# Altium schematic sheet 7-SOM PIO.SchDoc
size 420 x 297 mm; CompanyName: Microchip Technology Inc.; Organization: Microchip Technology; Address1: 2355 West Chandler Blvd.; Address2: Chandler, AZ  85224; Address4: USA; SheetTitle: **; Time: Time
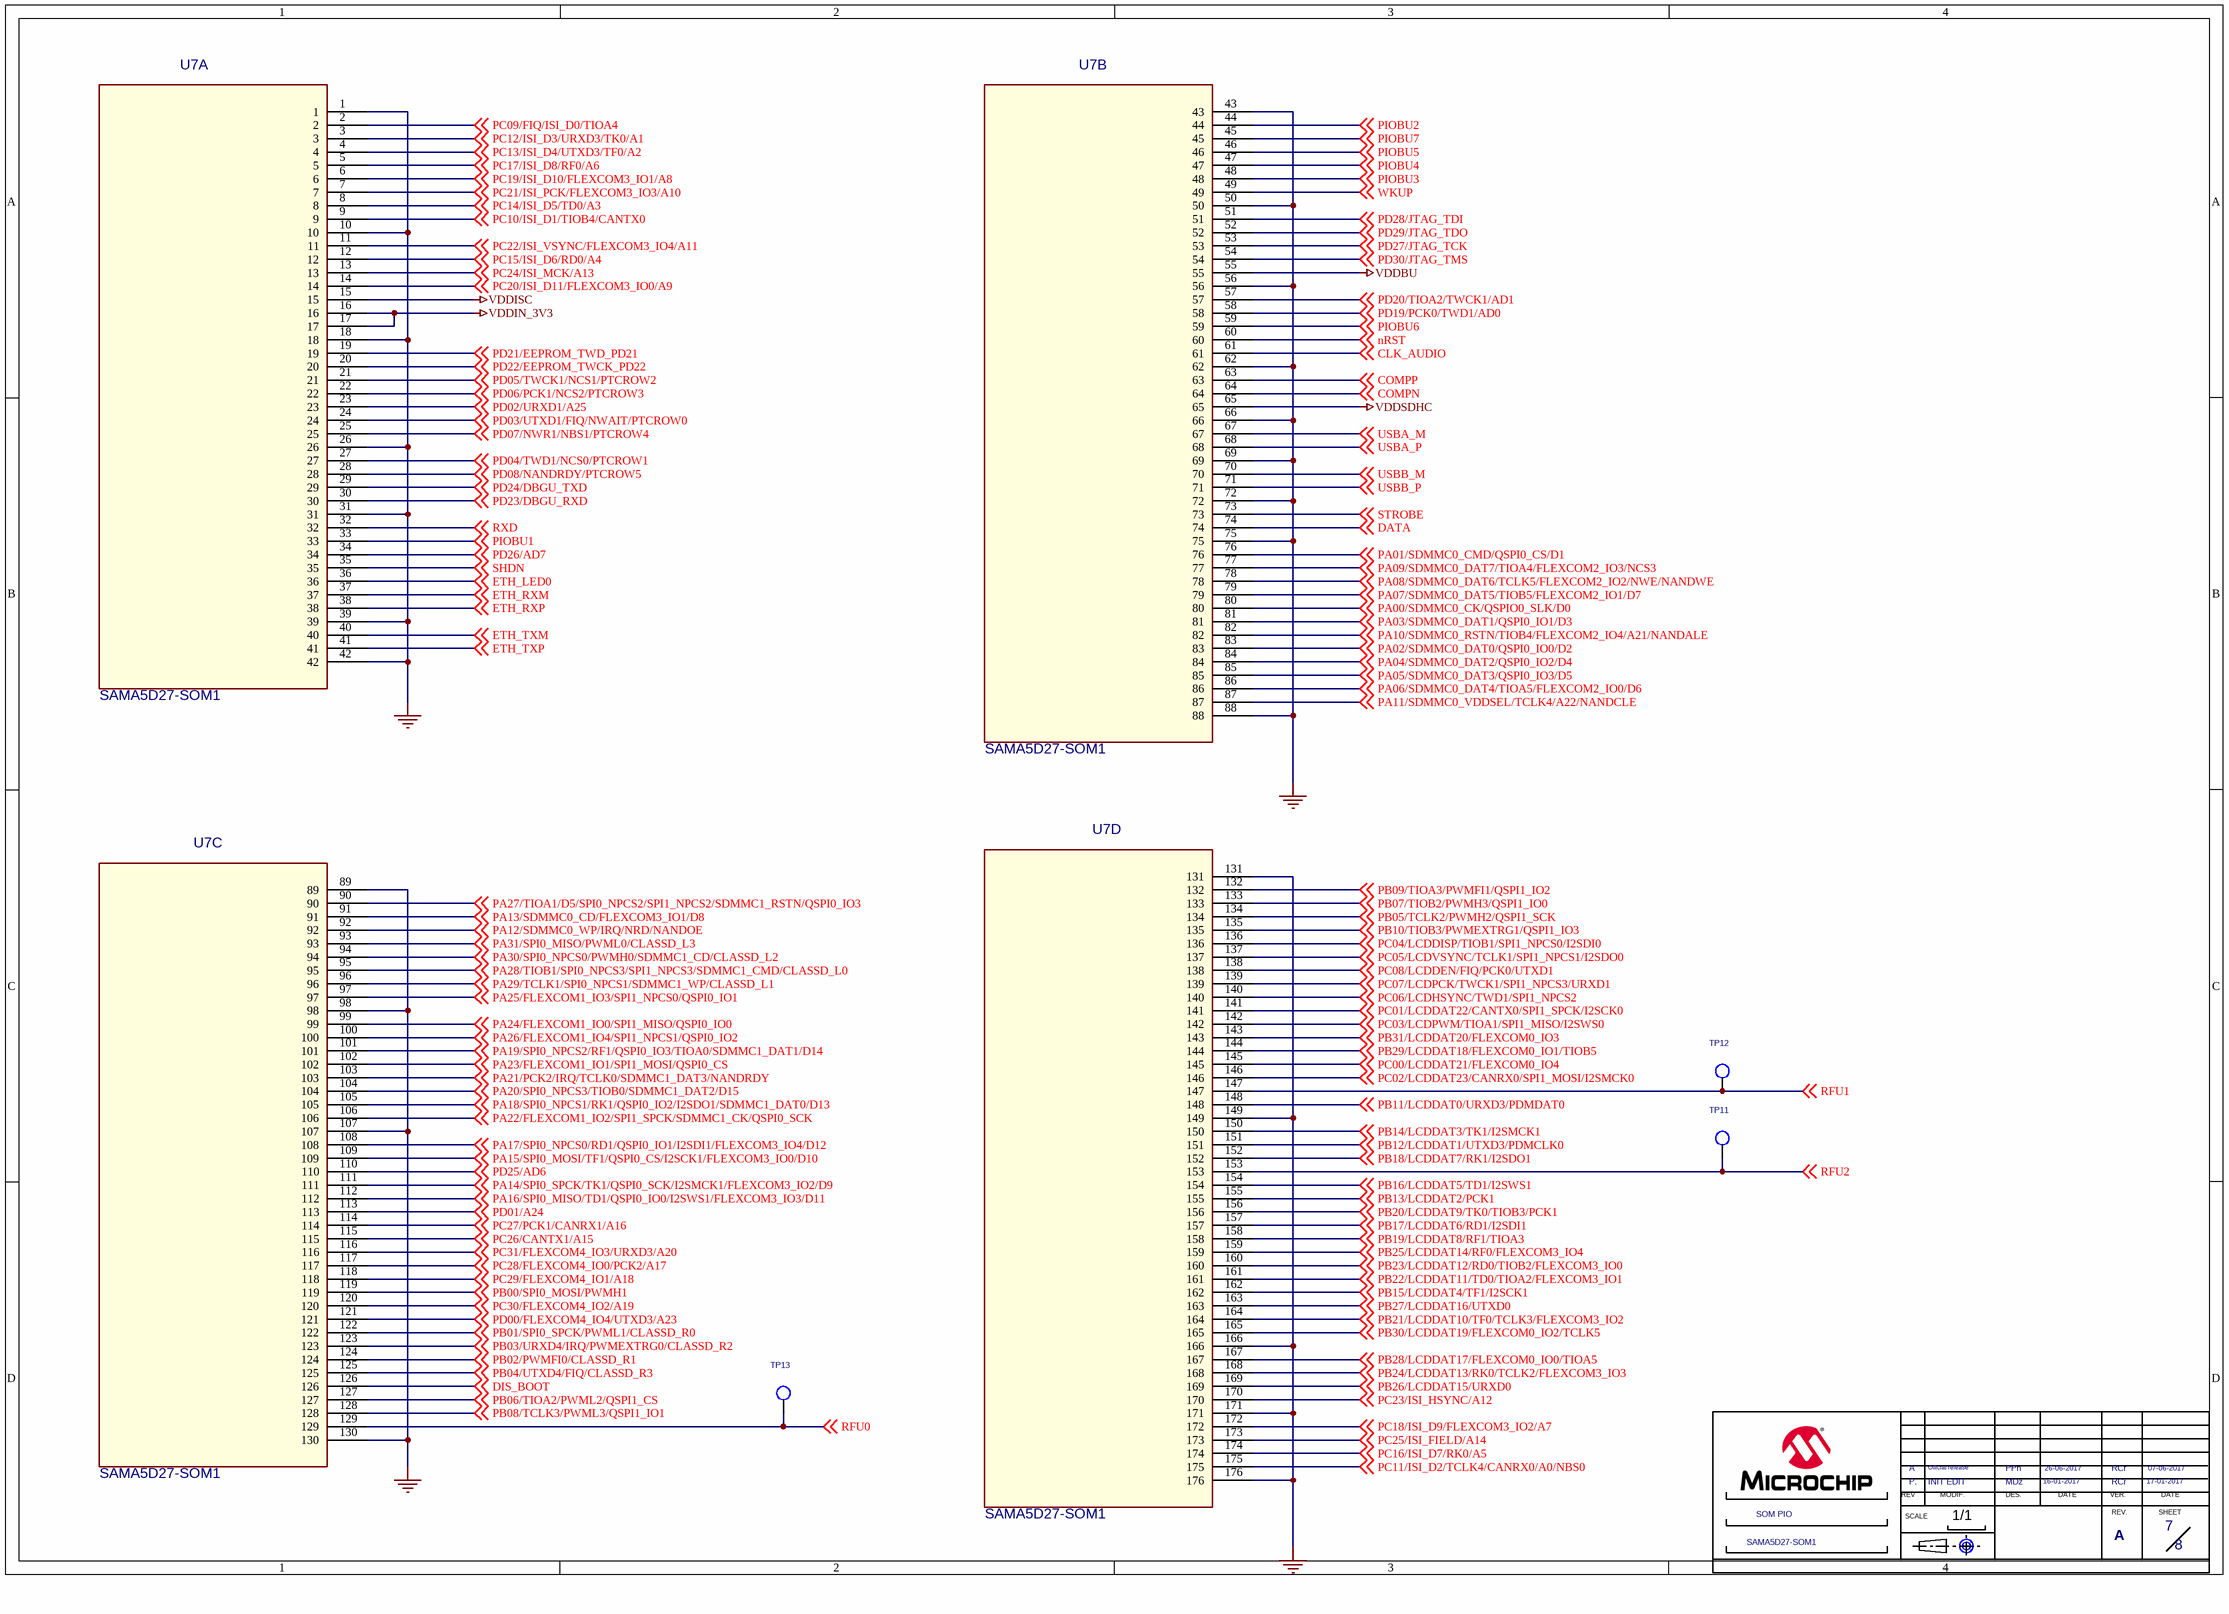
[diagram p0: 7-SOM PIO.SchDoc]

## Parts
*  MODIF.A: INIT EDIT  SHEET NAME 2: SOM PIO  SHEET NAME 1: SAMA5D27-SOM1  REV B: A  VERIF B: RCr  VERIF DATE A: 17-01-2017  VERIF DATE B: 07-06-2017  Page Count: 8  Page Number: 7  DATE A: 16-01-2017  DATE B: 26-06-2017  DES A: MDz  DES B: PPn  MODIF.B: Official release  REV A: P.  (hidden comment: CARTOUCHE MICROCHIP)  (graphical)
?  (no value)  (graphical)
TP11  TP  [tp-cmsrond-1mm_02]  (value not drawn)
TP12  TP  [tp-cmsrond-1mm_02]  (value not drawn)
TP13  TP  [tp-cmsrond-1mm_02]  (value not drawn)
U7  SAMA5D27-SOM1  [SAMA5D27-DXG-SOM1]  (parts A,B,C,D of 4)

## Nets
GND: U7.1 U7.10 U7.18 U7.26 U7.31 U7.39 U7.42 U7.43 U7.50 U7.56 U7.62 U7.66 U7.69 U7.72 U7.75 U7.88 U7.89 U7.98 U7.107 U7.130 U7.131 U7.149 U7.166 U7.171 U7.176
VDDBU: U7.55
VDDIN_3V3: U7.16 U7.17
VDDISC: U7.15
VDDSDHC: U7.65
CLK_AUDIO: U7.61 ; off-sheet CLK_AUDIO
COMPN: U7.64 ; off-sheet COMPN
COMPP: U7.63 ; off-sheet COMPP
DATA: U7.74 ; off-sheet DATA
DIS_BOOT: U7.126 ; off-sheet DIS_BOOT
ETH_LED0: U7.36 ; off-sheet ETH_LED0
ETH_RXM: U7.37 ; off-sheet ETH_RXM
ETH_RXP: U7.38 ; off-sheet ETH_RXP
ETH_TXM: U7.40 ; off-sheet ETH_TXM
ETH_TXP: U7.41 ; off-sheet ETH_TXP
nRST: U7.60 ; off-sheet nRST
PA00/SDMMC0_CK/QSPIO0_SLK/D0: U7.80 ; off-sheet PA00/SDMMC0_CK/QSPIO0_SLK/D0
PA01/SDMMC0_CMD/QSPI0_CS/D1: U7.76 ; off-sheet PA01/SDMMC0_CMD/QSPI0_CS/D1
PA02/SDMMC0_DAT0/QSPI0_IO0/D2: U7.83 ; off-sheet PA02/SDMMC0_DAT0/QSPI0_IO0/D2
PA03/SDMMC0_DAT1/QSPI0_IO1/D3: U7.81 ; off-sheet PA03/SDMMC0_DAT1/QSPI0_IO1/D3
PA04/SDMMC0_DAT2/QSPI0_IO2/D4: U7.84 ; off-sheet PA04/SDMMC0_DAT2/QSPI0_IO2/D4
PA05/SDMMC0_DAT3/QSPI0_IO3/D5: U7.85 ; off-sheet PA05/SDMMC0_DAT3/QSPI0_IO3/D5
PA06/SDMMC0_DAT4/TIOA5/FLEXCOM2_IO0/D6: U7.86 ; off-sheet PA06/SDMMC0_DAT4/TIOA5/FLEXCOM2_IO0/D6
PA07/SDMMC0_DAT5/TIOB5/FLEXCOM2_IO1/D7: U7.79 ; off-sheet PA07/SDMMC0_DAT5/TIOB5/FLEXCOM2_IO1/D7
PA08/SDMMC0_DAT6/TCLK5/FLEXCOM2_IO2/NWE/NANDWE: U7.78 ; off-sheet PA08/SDMMC0_DAT6/TCLK5/FLEXCOM2_IO2/NWE/NANDWE
PA09/SDMMC0_DAT7/TIOA4/FLEXCOM2_IO3/NCS3: U7.77 ; off-sheet PA09/SDMMC0_DAT7/TIOA4/FLEXCOM2_IO3/NCS3
PA10/SDMMC0_RSTN/TIOB4/FLEXCOM2_IO4/A21/NANDALE: U7.82 ; off-sheet PA10/SDMMC0_RSTN/TIOB4/FLEXCOM2_IO4/A21/NANDALE
PA11/SDMMC0_VDDSEL/TCLK4/A22/NANDCLE: U7.87 ; off-sheet PA11/SDMMC0_VDDSEL/TCLK4/A22/NANDCLE
PA12/SDMMC0_WP/IRQ/NRD/NANDOE: U7.92 ; off-sheet PA12/SDMMC0_WP/IRQ/NRD/NANDOE
PA13/SDMMC0_CD/FLEXCOM3_IO1/D8: U7.91 ; off-sheet PA13/SDMMC0_CD/FLEXCOM3_IO1/D8
PA14/SPI0_SPCK/TK1/QSPI0_SCK/I2SMCK1/FLEXCOM3_IO2/D9: U7.111 ; off-sheet PA14/SPI0_SPCK/TK1/QSPI0_SCK/I2SMCK1/FLEXCOM3_IO2/D9
PA15/SPI0_MOSI/TF1/QSPI0_CS/I2SCK1/FLEXCOM3_IO0/D10: U7.109 ; off-sheet PA15/SPI0_MOSI/TF1/QSPI0_CS/I2SCK1/FLEXCOM3_IO0/D10
PA16/SPI0_MISO/TD1/QSPI0_IO0/I2SWS1/FLEXCOM3_IO3/D11: U7.112 ; off-sheet PA16/SPI0_MISO/TD1/QSPI0_IO0/I2SWS1/FLEXCOM3_IO3/D11
PA17/SPI0_NPCS0/RD1/QSPI0_IO1/I2SDI1/FLEXCOM3_IO4/D12: U7.108 ; off-sheet PA17/SPI0_NPCS0/RD1/QSPI0_IO1/I2SDI1/FLEXCOM3_IO4/D12
PA18/SPI0_NPCS1/RK1/QSPI0_IO2/I2SDO1/SDMMC1_DAT0/D13: U7.105 ; off-sheet PA18/SPI0_NPCS1/RK1/QSPI0_IO2/I2SDO1/SDMMC1_DAT0/D13
PA19/SPI0_NPCS2/RF1/QSPI0_IO3/TIOA0/SDMMC1_DAT1/D14: U7.101 ; off-sheet PA19/SPI0_NPCS2/RF1/QSPI0_IO3/TIOA0/SDMMC1_DAT1/D14
PA20/SPI0_NPCS3/TIOB0/SDMMC1_DAT2/D15: U7.104 ; off-sheet PA20/SPI0_NPCS3/TIOB0/SDMMC1_DAT2/D15
PA21/PCK2/IRQ/TCLK0/SDMMC1_DAT3/NANDRDY: U7.103 ; off-sheet PA21/PCK2/IRQ/TCLK0/SDMMC1_DAT3/NANDRDY
PA22/FLEXCOM1_IO2/SPI1_SPCK/SDMMC1_CK/QSPI0_SCK: U7.106 ; off-sheet PA22/FLEXCOM1_IO2/SPI1_SPCK/SDMMC1_CK/QSPI0_SCK
PA23/FLEXCOM1_IO1/SPI1_MOSI/QSPI0_CS: U7.102 ; off-sheet PA23/FLEXCOM1_IO1/SPI1_MOSI/QSPI0_CS
PA24/FLEXCOM1_IO0/SPI1_MISO/QSPI0_IO0: U7.99 ; off-sheet PA24/FLEXCOM1_IO0/SPI1_MISO/QSPI0_IO0
PA25/FLEXCOM1_IO3/SPI1_NPCS0/QSPI0_IO1: U7.97 ; off-sheet PA25/FLEXCOM1_IO3/SPI1_NPCS0/QSPI0_IO1
PA26/FLEXCOM1_IO4/SPI1_NPCS1/QSPI0_IO2: U7.100 ; off-sheet PA26/FLEXCOM1_IO4/SPI1_NPCS1/QSPI0_IO2
PA27/TIOA1/D5/SPI0_NPCS2/SPI1_NPCS2/SDMMC1_RSTN/QSPI0_IO3: U7.90 ; off-sheet PA27/TIOA1/D5/SPI0_NPCS2/SPI1_NPCS2/SDMMC1_RSTN/QSPI0_IO3
PA28/TIOB1/SPI0_NPCS3/SPI1_NPCS3/SDMMC1_CMD/CLASSD_L0: U7.95 ; off-sheet PA28/TIOB1/SPI0_NPCS3/SPI1_NPCS3/SDMMC1_CMD/CLASSD_L0
PA29/TCLK1/SPI0_NPCS1/SDMMC1_WP/CLASSD_L1: U7.96 ; off-sheet PA29/TCLK1/SPI0_NPCS1/SDMMC1_WP/CLASSD_L1
PA30/SPI0_NPCS0/PWMH0/SDMMC1_CD/CLASSD_L2: U7.94 ; off-sheet PA30/SPI0_NPCS0/PWMH0/SDMMC1_CD/CLASSD_L2
PA31/SPI0_MISO/PWML0/CLASSD_L3: U7.93 ; off-sheet PA31/SPI0_MISO/PWML0/CLASSD_L3
PB00/SPI0_MOSI/PWMH1: U7.119 ; off-sheet PB00/SPI0_MOSI/PWMH1
PB01/SPI0_SPCK/PWML1/CLASSD_R0: U7.122 ; off-sheet PB01/SPI0_SPCK/PWML1/CLASSD_R0
PB02/PWMFI0/CLASSD_R1: U7.124 ; off-sheet PB02/PWMFI0/CLASSD_R1
PB03/URXD4/IRQ/PWMEXTRG0/CLASSD_R2: U7.123 ; off-sheet PB03/URXD4/IRQ/PWMEXTRG0/CLASSD_R2
PB04/UTXD4/FIQ/CLASSD_R3: U7.125 ; off-sheet PB04/UTXD4/FIQ/CLASSD_R3
PB05/TCLK2/PWMH2/QSPI1_SCK: U7.134 ; off-sheet PB05/TCLK2/PWMH2/QSPI1_SCK
PB06/TIOA2/PWML2/QSPI1_CS: U7.127 ; off-sheet PB06/TIOA2/PWML2/QSPI1_CS
PB07/TIOB2/PWMH3/QSPI1_IO0: U7.133 ; off-sheet PB07/TIOB2/PWMH3/QSPI1_IO0
PB08/TCLK3/PWML3/QSPI1_IO1: U7.128 ; off-sheet PB08/TCLK3/PWML3/QSPI1_IO1
PB09/TIOA3/PWMFI1/QSPI1_IO2: U7.132 ; off-sheet PB09/TIOA3/PWMFI1/QSPI1_IO2
PB10/TIOB3/PWMEXTRG1/QSPI1_IO3: U7.135 ; off-sheet PB10/TIOB3/PWMEXTRG1/QSPI1_IO3
PB11/LCDDAT0/URXD3/PDMDAT0: U7.148 ; off-sheet PB11/LCDDAT0/URXD3/PDMDAT0
PB12/LCDDAT1/UTXD3/PDMCLK0: U7.151 ; off-sheet PB12/LCDDAT1/UTXD3/PDMCLK0
PB13/LCDDAT2/PCK1: U7.155 ; off-sheet PB13/LCDDAT2/PCK1
PB14/LCDDAT3/TK1/I2SMCK1: U7.150 ; off-sheet PB14/LCDDAT3/TK1/I2SMCK1
PB15/LCDDAT4/TF1/I2SCK1: U7.162 ; off-sheet PB15/LCDDAT4/TF1/I2SCK1
PB16/LCDDAT5/TD1/I2SWS1: U7.154 ; off-sheet PB16/LCDDAT5/TD1/I2SWS1
PB17/LCDDAT6/RD1/I2SDI1: U7.157 ; off-sheet PB17/LCDDAT6/RD1/I2SDI1
PB18/LCDDAT7/RK1/I2SDO1: U7.152 ; off-sheet PB18/LCDDAT7/RK1/I2SDO1
PB19/LCDDAT8/RF1/TIOA3: U7.158 ; off-sheet PB19/LCDDAT8/RF1/TIOA3
PB20/LCDDAT9/TK0/TIOB3/PCK1: U7.156 ; off-sheet PB20/LCDDAT9/TK0/TIOB3/PCK1
PB21/LCDDAT10/TF0/TCLK3/FLEXCOM3_IO2: U7.164 ; off-sheet PB21/LCDDAT10/TF0/TCLK3/FLEXCOM3_IO2
PB22/LCDDAT11/TD0/TIOA2/FLEXCOM3_IO1: U7.161 ; off-sheet PB22/LCDDAT11/TD0/TIOA2/FLEXCOM3_IO1
PB23/LCDDAT12/RD0/TIOB2/FLEXCOM3_IO0: U7.160 ; off-sheet PB23/LCDDAT12/RD0/TIOB2/FLEXCOM3_IO0
PB24/LCDDAT13/RK0/TCLK2/FLEXCOM3_IO3: U7.168 ; off-sheet PB24/LCDDAT13/RK0/TCLK2/FLEXCOM3_IO3
PB25/LCDDAT14/RF0/FLEXCOM3_IO4: U7.159 ; off-sheet PB25/LCDDAT14/RF0/FLEXCOM3_IO4
PB26/LCDDAT15/URXD0: U7.169 ; off-sheet PB26/LCDDAT15/URXD0
PB27/LCDDAT16/UTXD0: U7.163 ; off-sheet PB27/LCDDAT16/UTXD0
PB28/LCDDAT17/FLEXCOM0_IO0/TIOA5: U7.167 ; off-sheet PB28/LCDDAT17/FLEXCOM0_IO0/TIOA5
PB29/LCDDAT18/FLEXCOM0_IO1/TIOB5: U7.144 ; off-sheet PB29/LCDDAT18/FLEXCOM0_IO1/TIOB5
PB30/LCDDAT19/FLEXCOM0_IO2/TCLK5: U7.165 ; off-sheet PB30/LCDDAT19/FLEXCOM0_IO2/TCLK5
PB31/LCDDAT20/FLEXCOM0_IO3: U7.143 ; off-sheet PB31/LCDDAT20/FLEXCOM0_IO3
PC00/LCDDAT21/FLEXCOM0_IO4: U7.145 ; off-sheet PC00/LCDDAT21/FLEXCOM0_IO4
PC01/LCDDAT22/CANTX0/SPI1_SPCK/I2SCK0: U7.141 ; off-sheet PC01/LCDDAT22/CANTX0/SPI1_SPCK/I2SCK0
PC02/LCDDAT23/CANRX0/SPI1_MOSI/I2SMCK0: U7.146 ; off-sheet PC02/LCDDAT23/CANRX0/SPI1_MOSI/I2SMCK0
PC03/LCDPWM/TIOA1/SPI1_MISO/I2SWS0: U7.142 ; off-sheet PC03/LCDPWM/TIOA1/SPI1_MISO/I2SWS0
PC04/LCDDISP/TIOB1/SPI1_NPCS0/I2SDI0: U7.136 ; off-sheet PC04/LCDDISP/TIOB1/SPI1_NPCS0/I2SDI0
PC05/LCDVSYNC/TCLK1/SPI1_NPCS1/I2SDO0: U7.137 ; off-sheet PC05/LCDVSYNC/TCLK1/SPI1_NPCS1/I2SDO0
PC06/LCDHSYNC/TWD1/SPI1_NPCS2: U7.140 ; off-sheet PC06/LCDHSYNC/TWD1/SPI1_NPCS2
PC07/LCDPCK/TWCK1/SPI1_NPCS3/URXD1: U7.139 ; off-sheet PC07/LCDPCK/TWCK1/SPI1_NPCS3/URXD1
PC08/LCDDEN/FIQ/PCK0/UTXD1: U7.138 ; off-sheet PC08/LCDDEN/FIQ/PCK0/UTXD1
PC09/FIQ/ISI_D0/TIOA4: U7.2 ; off-sheet PC09/FIQ/ISI_D0/TIOA4
PC10/ISI_D1/TIOB4/CANTX0: U7.9 ; off-sheet PC10/ISI_D1/TIOB4/CANTX0
PC11/ISI_D2/TCLK4/CANRX0/A0/NBS0: U7.175 ; off-sheet PC11/ISI_D2/TCLK4/CANRX0/A0/NBS0
PC12/ISI_D3/URXD3/TK0/A1: U7.3 ; off-sheet PC12/ISI_D3/URXD3/TK0/A1
PC13/ISI_D4/UTXD3/TF0/A2: U7.4 ; off-sheet PC13/ISI_D4/UTXD3/TF0/A2
PC14/ISI_D5/TD0/A3: U7.8 ; off-sheet PC14/ISI_D5/TD0/A3
PC15/ISI_D6/RD0/A4: U7.12 ; off-sheet PC15/ISI_D6/RD0/A4
PC16/ISI_D7/RK0/A5: U7.174 ; off-sheet PC16/ISI_D7/RK0/A5
PC17/ISI_D8/RF0/A6: U7.5 ; off-sheet PC17/ISI_D8/RF0/A6
PC18/ISI_D9/FLEXCOM3_IO2/A7: U7.172 ; off-sheet PC18/ISI_D9/FLEXCOM3_IO2/A7
PC19/ISI_D10/FLEXCOM3_IO1/A8: U7.6 ; off-sheet PC19/ISI_D10/FLEXCOM3_IO1/A8
PC20/ISI_D11/FLEXCOM3_IO0/A9: U7.14 ; off-sheet PC20/ISI_D11/FLEXCOM3_IO0/A9
PC21/ISI_PCK/FLEXCOM3_IO3/A10: U7.7 ; off-sheet PC21/ISI_PCK/FLEXCOM3_IO3/A10
PC22/ISI_VSYNC/FLEXCOM3_IO4/A11: U7.11 ; off-sheet PC22/ISI_VSYNC/FLEXCOM3_IO4/A11
PC23/ISI_HSYNC/A12: U7.170 ; off-sheet PC23/ISI_HSYNC/A12
PC24/ISI_MCK/A13: U7.13 ; off-sheet PC24/ISI_MCK/A13
PC25/ISI_FIELD/A14: U7.173 ; off-sheet PC25/ISI_FIELD/A14
PC26/CANTX1/A15: U7.115 ; off-sheet PC26/CANTX1/A15
PC27/PCK1/CANRX1/A16: U7.114 ; off-sheet PC27/PCK1/CANRX1/A16
PC28/FLEXCOM4_IO0/PCK2/A17: U7.117 ; off-sheet PC28/FLEXCOM4_IO0/PCK2/A17
PC29/FLEXCOM4_IO1/A18: U7.118 ; off-sheet PC29/FLEXCOM4_IO1/A18
PC30/FLEXCOM4_IO2/A19: U7.120 ; off-sheet PC30/FLEXCOM4_IO2/A19
PC31/FLEXCOM4_IO3/URXD3/A20: U7.116 ; off-sheet PC31/FLEXCOM4_IO3/URXD3/A20
PD00/FLEXCOM4_IO4/UTXD3/A23: U7.121 ; off-sheet PD00/FLEXCOM4_IO4/UTXD3/A23
PD01/A24: U7.113 ; off-sheet PD01/A24
PD02/URXD1/A25: U7.23 ; off-sheet PD02/URXD1/A25
PD03/UTXD1/FIQ/NWAIT/PTCROW0: U7.24 ; off-sheet PD03/UTXD1/FIQ/NWAIT/PTCROW0
PD04/TWD1/NCS0/PTCROW1: U7.27 ; off-sheet PD04/TWD1/NCS0/PTCROW1
PD05/TWCK1/NCS1/PTCROW2: U7.21 ; off-sheet PD05/TWCK1/NCS1/PTCROW2
PD06/PCK1/NCS2/PTCROW3: U7.22 ; off-sheet PD06/PCK1/NCS2/PTCROW3
PD07/NWR1/NBS1/PTCROW4: U7.25 ; off-sheet PD07/NWR1/NBS1/PTCROW4
PD08/NANDRDY/PTCROW5: U7.28 ; off-sheet PD08/NANDRDY/PTCROW5
PD19/PCK0/TWD1/AD0: U7.58 ; off-sheet PD19/PCK0/TWD1/AD0
PD20/TIOA2/TWCK1/AD1: U7.57 ; off-sheet PD20/TIOA2/TWCK1/AD1
PD21/EEPROM_TWD_PD21: U7.19 ; off-sheet PD21/EEPROM_TWD_PD21
PD22/EEPROM_TWCK_PD22: U7.20 ; off-sheet PD22/EEPROM_TWCK_PD22
PD23/DBGU_RXD: U7.30 ; off-sheet PD23/DBGU_RXD
PD24/DBGU_TXD: U7.29 ; off-sheet PD24/DBGU_TXD
PD25/AD6: U7.110 ; off-sheet PD25/AD6
PD26/AD7: U7.34 ; off-sheet PD26/AD7
PD27/JTAG_TCK: U7.53 ; off-sheet PD27/JTAG_TCK
PD28/JTAG_TDI: U7.51 ; off-sheet PD28/JTAG_TDI
PD29/JTAG_TDO: U7.52 ; off-sheet PD29/JTAG_TDO
PD30/JTAG_TMS: U7.54 ; off-sheet PD30/JTAG_TMS
PIOBU1: U7.33 ; off-sheet PIOBU1
PIOBU2: U7.44 ; off-sheet PIOBU2
PIOBU3: U7.48 ; off-sheet PIOBU3
PIOBU4: U7.47 ; off-sheet PIOBU4
PIOBU5: U7.46 ; off-sheet PIOBU5
PIOBU6: U7.59 ; off-sheet PIOBU6
PIOBU7: U7.45 ; off-sheet PIOBU7
RFU0: TP13.1 U7.129 ; off-sheet RFU0
RFU1: TP12.1 U7.147 ; off-sheet RFU1
RFU2: TP11.1 U7.153 ; off-sheet RFU2
RXD: U7.32 ; off-sheet RXD
SHDN: U7.35 ; off-sheet SHDN
STROBE: U7.73 ; off-sheet STROBE
USBA_M: U7.67 ; off-sheet USBA_M
USBA_P: U7.68 ; off-sheet USBA_P
USBB_M: U7.70 ; off-sheet USBB_M
USBB_P: U7.71 ; off-sheet USBB_P
WKUP: U7.49 ; off-sheet WKUP

## Notes on the sheet
- Drawn By:
- Engineer:
- PartNumber:
- Project Title
- Sheet Title
- Size
- B
- Revision:
- Sch #:
- Date:
- Sheet
- Designed with
- Altium.com <http://go.altium.com/MicrochipLandingPage_Evaluation.html>
- File:
- (in symbol CARTOUCHE MICROCHIP) REV; MODIF.; DES.; DATE; VER.; SCALE; REV.; SHEET; 1/1

## Library data of the parts
* = CARTOUCHE MICROCHIP: REV D: D; REV C: C; REV F: F; REV E: E; VERIF F: XXX; VERIF DATE F: XX-XXX-XX; MODIF.C: RevC; MODIF.D: RevD; MODIF.E: RevE; MODIF.F: RevF; VERIF E: XXX; VERIF D: XXX; VERIF C: RCr; VERIF A: RCr; VERIF DATE E: XX-XXX-XX; VERIF DATE D: XX-XXX-XX; VERIF DATE C: 07-06-2017; REV: A; FT: ?; Page Size: A; Page Create Date: june 19, 2004; DATE C: 07-06-2017; DATE D: XX-XXX-XX; DATE E: XX-XXX-XX; DATE F: XX-XXX-XX; DES E: XXX; DES F: XXX; DES C: XXX; DES D: XXX
? = Title Block B
TP11-TP13 = TP: DESIGNATION: POINT DE TEST
U7 = SAMA5D27-SOM1-2